# EAGLE design ADCv1_16_4_12 (EAGLE 5.10)
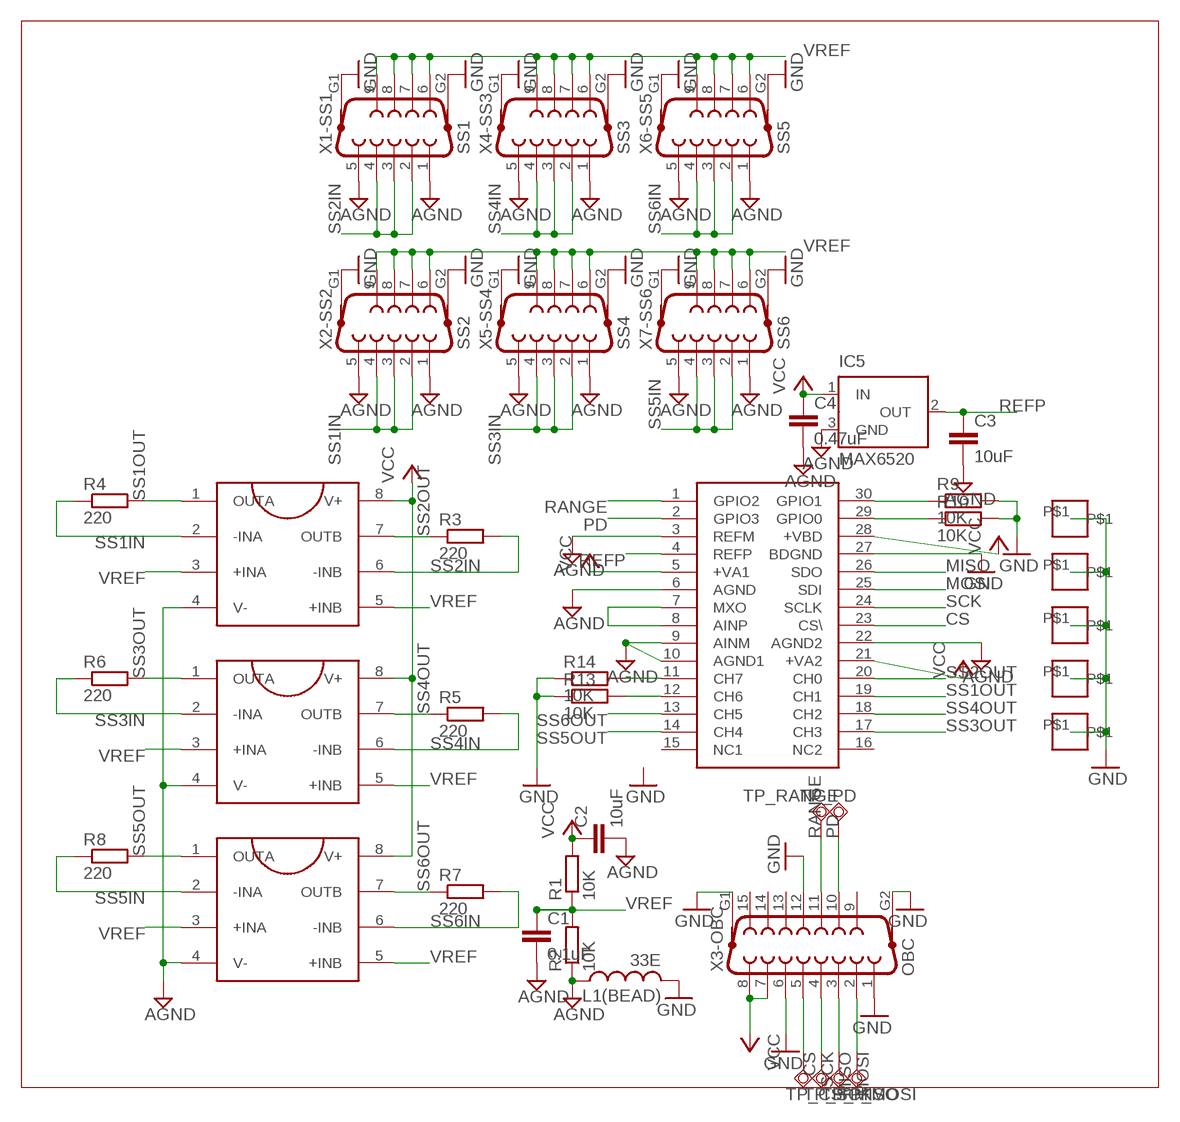
[diagram p0: schematic, sheet 1]

## Parts
C1  0.1uF  C-EUC1206  [C1206]
C2  10uF  C-EUC1206  [C1206]
C3  10uF  C-EUC1206  [C1206]
C4  0.47uF  C-EUC1206  [C1206]
IC1  ADS7951_  [TSSOP30_]
IC2  OPA2376  [SO-8]
IC3  OPA2376  [SO-8]
IC4  OPA2376  [SO-8]
IC5  MAX6520  [SOT23]
L1(BEAD)  33E  L-USL2012C  [L2012C]
R1  10K  R-EU_M1206  [M1206]
R2  10K  R-EU_M1206  [M1206]
R3  220  R-EU_M1206  [M1206]
R4  220  R-EU_M1206  [M1206]
R5  220  R-EU_M1206  [M1206]
R6  220  R-EU_M1206  [M1206]
R7  220  R-EU_M1206  [M1206]
R8  220  R-EU_M1206  [M1206]
R9  10K  R-EU_M1206  [M1206]
R10  10K  R-EU_M1206  [M1206]
R13  10K  R-EU_M1206  [M1206]
R14  10K  R-EU_M1206  [M1206]
TP_CS  TPSQTP12R  [TP12R]
TP_MISO  TPSQTP12R  [TP12R]
TP_MOSI  TPSQTP12R  [TP12R]
TP_PD  TPSQTP12R  [TP12R]
TP_RANGE  TPSQTP12R  [TP12R]
TP_SCK  TPSQTP12R  [TP12R]
U$1  MOUNT_SQ  [MOUNT_10MM]
U$6  MOUNT_SQ  [MOUNT_10MM]
U$7  MOUNT_SQ  [MOUNT_10MM]
U$8  MOUNT_SQ  [MOUNT_10MM]
U$9  MOUNT_SQ  [MOUNT_10MM]
X1-SS1  SS1  F09HP  [F09HP]
X2-SS2  SS2  F09HP  [F09HP]
X3-OBC  OBC  F15HP  [F15HP]
X4-SS3  SS3  F09HP  [F09HP]
X5-SS4  SS4  F09HP  [F09HP]
X6-SS5  SS5  F09HP  [F09HP]
X7-SS6  SS6  F09HP  [F09HP]

## Nets
AGND [Power]: C1.2 C2.2 C3.2 C4.2 IC1.3(REFM) IC1.6(AGND) IC1.9(AINM) IC1.10(AGND1) IC1.22(AGND2) IC2.4(V-) IC3.4(V-) IC4.4(V-) IC5.3(GND) L1(BEAD).1 R2.1 X1-SS1.1 X1-SS1.5 X2-SS2.1 X2-SS2.5 X4-SS3.1 X4-SS3.5 X5-SS4.1 X5-SS4.5 X6-SS5.1 X6-SS5.5 X7-SS6.1 X7-SS6.5
CS: IC1.23(CS\) TP_CS.TP X3-OBC.5
GND [Power]: IC1.27(BDGND) L1(BEAD).2 R9.2 R10.2 R13.1 R14.1 U$1.P$1 U$6.P$1 U$7.P$1 U$8.P$1 U$9.P$1 X1-SS1.G1 X1-SS1.G2 X2-SS2.G1 X2-SS2.G2 X3-OBC.1 X3-OBC.6 X3-OBC.12 X3-OBC.G1 X3-OBC.G2 X4-SS3.G1 X4-SS3.G2 X5-SS4.G1 X5-SS4.G2 X6-SS5.G1 X6-SS5.G2 X7-SS6.G1 X7-SS6.G2
MISO: IC1.26(SDO) TP_MISO.TP X3-OBC.3
MOSI: IC1.25(SDI) TP_MOSI.TP X3-OBC.2
N$1: IC1.7(MXO) IC1.8(AINP)
N$4: IC1.11(CH7) R14.2
N$5: IC1.12(CH6) R13.2
N$8: IC1.29(GPIO0) R10.1
N$9: IC1.30(GPIO1) R9.1
PD: IC1.2(GPIO3) TP_PD.TP X3-OBC.10
RANGE: IC1.1(GPIO2) TP_RANGE.TP X3-OBC.11
REFP: C3.1 IC1.4(REFP) IC5.2(OUT)
SCK: IC1.24(SCLK) TP_SCK.TP X3-OBC.4
SS1IN: IC2.2(-INA) R4.1 X2-SS2.2 X2-SS2.3 X2-SS2.4
SS1OUT: IC1.19(CH1) IC2.1(OUTA) R4.2
SS2IN: IC2.6(-INB) R3.2 X1-SS1.2 X1-SS1.3 X1-SS1.4
SS2OUT: IC1.20(CH0) IC2.7(OUTB) R3.1
SS3IN: IC3.2(-INA) R6.1 X5-SS4.2 X5-SS4.3 X5-SS4.4
SS3OUT: IC1.17(CH3) IC3.1(OUTA) R6.2
SS4IN: IC3.6(-INB) R5.2 X4-SS3.2 X4-SS3.3 X4-SS3.4
SS4OUT: IC1.18(CH2) IC3.7(OUTB) R5.1
SS5IN: IC4.2(-INA) R8.1 X7-SS6.2 X7-SS6.3 X7-SS6.4
SS5OUT: IC1.13(CH5) IC4.1(OUTA) R8.2
SS6IN: IC4.6(-INB) R7.2 X6-SS5.2 X6-SS5.3 X6-SS5.4
SS6OUT: IC1.14(CH4) IC4.7(OUTB) R7.1
VCC [Power]: C2.1 C4.1 IC1.5(+VA1) IC1.21(+VA2) IC1.28(+VBD) IC2.8(V+) IC3.8(V+) IC4.8(V+) IC5.1(IN) R1.2 X3-OBC.7 X3-OBC.8
VREF [Power]: C1.1 IC2.3(+INA) IC2.5(+INB) IC3.3(+INA) IC3.5(+INB) IC4.3(+INA) IC4.5(+INB) R1.1 R2.2 X1-SS1.6 X1-SS1.7 X1-SS1.8 X1-SS1.9 X2-SS2.6 X2-SS2.7 X2-SS2.8 X2-SS2.9 X4-SS3.6 X4-SS3.7 X4-SS3.8 X4-SS3.9 X5-SS4.6 X5-SS4.7 X5-SS4.8 X5-SS4.9 X6-SS5.6 X6-SS5.7 X6-SS5.8 X6-SS5.9 X7-SS6.6 X7-SS6.7 X7-SS6.8 X7-SS6.9
Unconnected: IC1.15(NC1) IC1.16(NC2) X3-OBC.9 X3-OBC.13 X3-OBC.14 X3-OBC.15

## Library data of the parts
C1-C4 = rcl:C-EU: CAPACITOR, European symbol
IC1 = satellite:ADS7951_
IC2-IC4 = satellite:OPA2376
IC5 = maxim:MAX6520: 1.2V Voltage Reference 50ppm/°C, SOT23, 3-Terminal Source: http://datasheets.maxim-ic.com/en/ds/MAX6520.pdf
L1(BEAD) = rcl:L-US: INDUCTOR, American symbol
R1 R2 = rcl:R-EU_: RESISTOR, European symbol
R3-R10 R13 R14 = satellite:R-EU_: RESISTOR, European symbol
TP_CS TP_MISO TP_MOSI TP_PD TP_RANGE TP_SCK = testpad:TPSQ: Test pad
U$1 U$6-U$9 = satellite:MOUNT_SQ
X1-SS1 X2-SS2 X4-SS3 X5-SS4 X6-SS5 X7-SS6 = satellite:F09HP: SUB-D
X3-OBC = satellite:F15HP: SUB-D

## Net classes
0 Signal: width 0.305 mm, clearance 0.254 mm
1 Power: width 0.61 mm, clearance 0.508 mm to class 0, clearance 0.508 mm

## Board
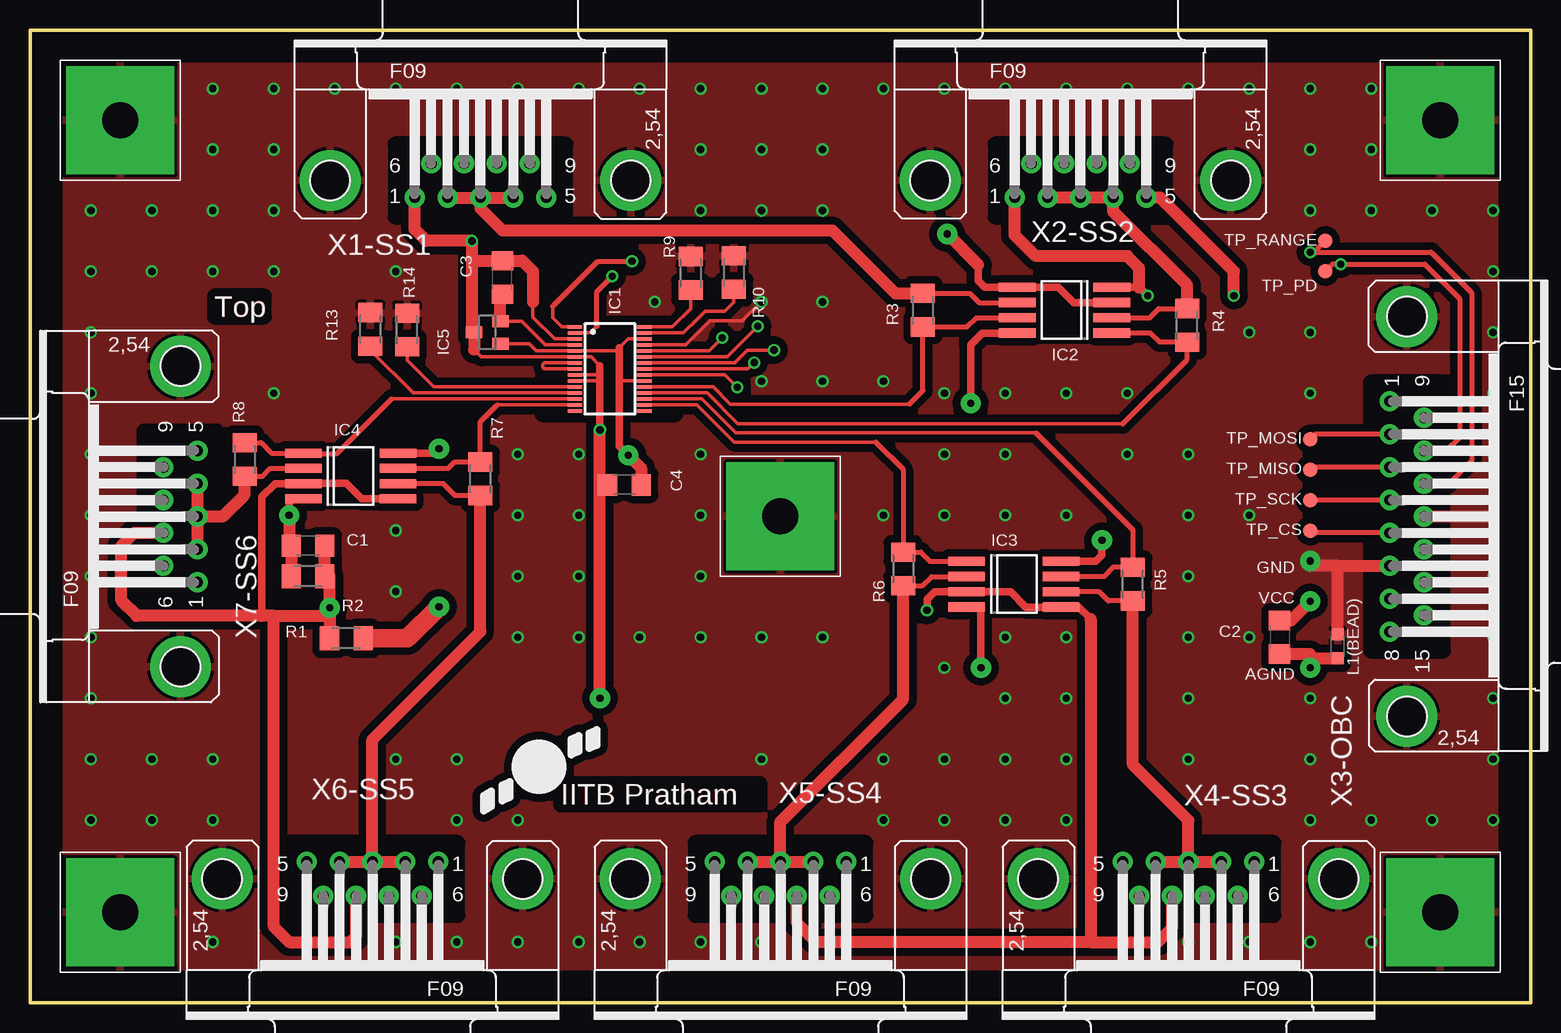
[diagram p1: board, top side]
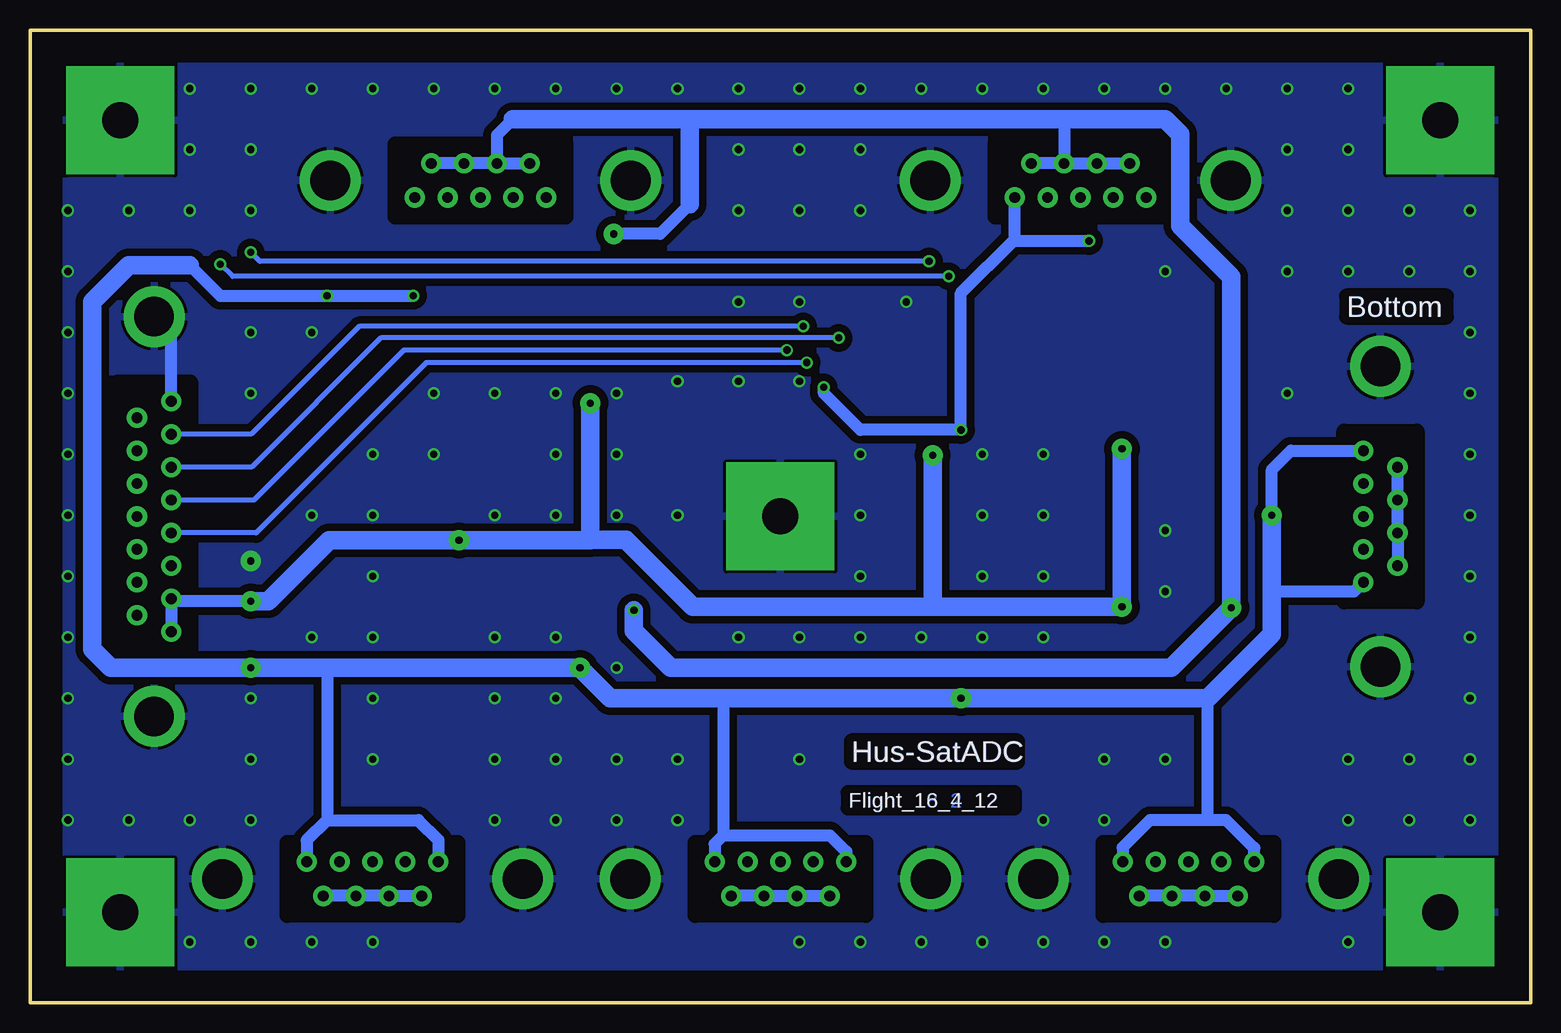
[diagram p2: board, bottom side, seen from below]

Size 125.08 x 81.08 mm. Coordinates in mm from the lower left corner, seen from the top.
Outline: 0,0 125.08,0 125.08,81.08 0,81.08 0,0
Copper layers (1*16): Top 0.07mm / dielectric 1.5mm / Bottom 0.07mm
Design rules "satellite": minimum track width 10mil, minimum drill 20mil, track to track 6mil, track to pad 6mil, pad to pad 6mil, via to via 6mil, smd to smd 6mil, copper to edge 100mil, drill to drill 8mil, minimum pad ring 10mil, minimum via ring 8mil, stop-mask expansion 4mil, vias tented up to drill 0mil, thermal gap 10mil
tRestrict: area 42.7,49 to 53.8,56.6

### Footprints (pad centres in the part's own frame; a part is rotated, then mirrored left to right if it is on the bottom)
C1206 = smd 1.6 x 1.8: 1 -1.4,0; 2 1.4,0
TSSOP30_ = smd 0.3 x 1.2: 1 -3.5,-2.9; 2 -3,-2.9; 3 -2.5,-2.9; 4 -2,-2.9; 5 -1.5,-2.9; 6 -1,-2.9; 7 -0.5,-2.9; 8 0,-2.9; 9 0.5,-2.9; 10 1,-2.9; 11 1.5,-2.9; 12 2,-2.9; 13 2.5,-2.9; 14 3,-2.9; 15 3.5,-2.9; 16 3.5,2.9; 17 3,2.9; 18 2.5,2.9; 19 2,2.9; 20 1.5,2.9; 21 1,2.9; 22 0.5,2.9; 23 0,2.9; 24 -0.5,2.9; 25 -1,2.9; 26 -1.5,2.9; 27 -2,2.9; 28 -2.5,2.9; 29 -3,2.9; 30 -3.5,2.9
SO-8 = smd 0.762 x 3.048: 1 -1.905,-3.937; 2 -0.635,-3.937; 3 0.635,-3.937; 4 1.905,-3.937; 5 1.905,3.937; 6 0.635,3.937; 7 -0.635,3.937; 8 -1.905,3.937
SOT23 = smd 1 x 1.4: 1 -0.95,-1.1; 2 0.95,-1.1; 3 0,1.1
L2012C = smd 1 x 1: 1 -1,0; 2 1,0
M1206 = smd 1.6 x 2: 1 -1.4,0; 2 1.4,0
TP12R = smd 1.2 x 1.2: TP 0,0
MOUNT_10MM = drill 3 pad 9 square: P$1 0,0
F09HP = drill 0.9 pad 1.676 round: 1 -5.486,-1.422; 2 -2.743,-1.422; 3 0,-1.422; 4 2.743,-1.422; 5 5.486,-1.422; 6 -4.115,1.422; 7 -1.372,1.422; 8 1.372,1.422; 9 4.115,1.422 | drill 3.302 pad 5.08 round: G1 -12.522,0; G2 12.522,0
F15HP = drill 0.9 pad 1.676 round: 1 -9.601,-1.422; 2 -6.858,-1.422; 3 -4.115,-1.422; 4 -1.372,-1.422; 5 1.372,-1.422; 6 4.115,-1.422; 7 6.858,-1.422; 8 9.601,-1.422; 9 -8.23,1.422; 10 -5.486,1.422; 11 -2.743,1.422; 12 0,1.422; 13 2.743,1.422; 14 5.486,1.422; 15 8.23,1.422 | drill 3.302 pad 5.08 round: G1 16.662,0; G2 -16.662,0

### Placement (x,y rotation side)
C1  23.16,38.1 180 top
C2  104.14,30.48 270 top
C3  39.37,60.45 90 top
C4  49.53,43.18 180 top
IC1  48.32,52.83 270 top
IC2  86.21,57.73 90 top
IC3  81.99,34.9 270 top
IC4  26.72,43.92 270 top
IC5  38.1,55.88 90 top
L1(BEAD)  108.97,29.72 90 top
R1  26.37,30.38 0 top
R2  23.16,35.56 0 top
R3  74.4,57.73 90 top
R4  96.42,56.46 270 top
R5  91.9,34.9 270 top
R6  72.76,36.17 90 top
R7  37.54,43.69 270 top
R8  17.88,45.29 90 top
R9  55.04,60.81 90 top
R10  58.66,60.87 90 top
R13  28.37,56.13 270 top
R14  31.42,56.08 270 top
TP_CS  106.68,39.37 0 top
TP_MISO  106.68,44.45 0 top
TP_MOSI  106.68,46.99 0 top
TP_PD  107.95,60.96 0 top
TP_RANGE  107.95,63.5 0 top
TP_SCK  106.68,41.91 0 top
U$1  7.54,7.54 0 top
U$6  7.54,73.54 0 top
U$7  117.54,7.54 0 top
U$8  117.54,73.54 0 top
U$9  62.54,40.54 0 top
X1-SS1  37.54,68.54 0 top
X2-SS2  87.54,68.54 0 top
X3-OBC  114.74,40.54 270 top
X4-SS3  96.54,10.34 180 top
X5-SS4  62.54,10.34 180 top
X6-SS5  28.54,10.34 180 top
X7-SS6  12.54,40.54 90 top

### Tracks (layer width: path | path; a pad name or v marks a point on that pad's centre or on a via)
AGND  (via drill 0.6, 0.6 pad 1.68)
  Top 0.305: IC1.22 57.9,52.33 v58.93,51.31 | 47.5,53.09 46.75,53.83 IC1.6 37.61,53.83 37,54.44 | IC1.3 43.73,55.33 41.91,57.15 41.91,58.42 | 47.5,52.33 IC1.9 | 47.5,51.83 IC1.10
  Top 0.61: v79.25,27.94 79.25,32.99 IC3.4 | IC2.4 92.43,59.64 v93.14,58.93 | v21.59,40.64 21.59,42.01 IC4.4 | 47.5,53.09 47.5,52.33 47.5,51.83 v47.5,47.75
  Top 1.016: v21.59,40.64 21.59,38.1 C1.2 R2.1 | X2-SS2.1 82.05,64 83.82,62.23 91.44,62.23 92.43,61.24 92.43,59.64 | X2-SS2.5 94.17,67.12 100.33,60.96 v100.33,58.93 | X1-SS1.1 32.05,64.47 33.02,63.5 v36.83,63.5 36.83,61.85 | C2.2 106.68,29.08 106.68,28.72 | v106.68,27.94 106.68,28.72 | 106.68,28.72 L1(BEAD).1 | 41.91,58.42 41.91,60.96 41.02,61.85 C3.2 36.83,61.85 | 47.5,43.18 C4.2 | 47.5,43.18 v47.5,47.75 | v47.5,25.4 47.5,43.18 | 36.83,61.85 36.83,55.88 IC5.3 37,54.44
  Bottom 1.016: v58.93,51.31 58.93,50.8 55.88,47.75 v47.5,47.75 47.5,59.18 43.03,63.65 | v93.14,58.93 v100.33,58.93 109.22,58.93 111.76,61.47 | X7-SS6.1 14.73,34.29 21.59,34.29 | X7-SS6.5 20.01,46.03 21.59,44.45 v21.59,40.64 | X6-SS5.5 23.05,12.89 25.4,15.24 26.92,15.24 | X6-SS5.1 34.03,12.96 31.75,15.24 26.92,15.24 | X5-SS4.5 57.05,12.6 58.42,13.97 67.31,13.97 | 67.31,25.4 67.31,13.97 | X5-SS4.1 68.03,13.25 67.31,13.97 | X4-SS3.1 102.03,13.54 100.33,15.24 | 100.33,27.94 100.33,15.24 | X4-SS3.5 91.05,13.58 92.71,15.24 100.33,15.24 | 26.92,15.24 26.92,25.4 | 43.03,63.65 X1-SS1.5 | 43.03,63.65 42.87,63.5 v36.83,63.5
  Bottom 1.524: v21.59,40.64 21.59,34.29 21.59,30.73 26.92,25.4 v47.5,25.4 67.31,25.4 76.71,25.4 v79.25,27.94 100.33,27.94 v106.68,27.94 118.36,27.94 119.89,29.46 119.89,58.42 116.84,61.47 111.76,61.47
CS  (via drill 0.6 pad 0.3)
  Top 0.305: v60.35,53.37 59.82,52.83 IC1.23
  Top 0.406: TP_CS.TP 106.88,39.17 X3-OBC.5
  Bottom 0.406: v60.35,53.37 92.05,53.37 106.25,39.17 X3-OBC.5
GND  (via drill 0.6, 0.6 pad 1.68)
  Top 0.305: IC1.27 54.64,54.83 56.64,56.83 59.37,56.83 v60.96,58.42
  Top 1.016: X3-OBC.12 121.82,40.54 v121.92,40.64 | L1(BEAD).2 108.97,36.42 | 108.97,36.42 X3-OBC.6 | v106.68,36.83 106.68,36.42 108.97,36.42
  Bottom 1.016: X3-OBC.G1 116.01,25.15 | X3-OBC.1 113.32,55.78 X3-OBC.G2
  other vias: 5.08,15.24 5.08,20.32 5.08,25.4 10.16,20.32 15.24,20.32 15.24,15.24 10.16,15.24 5.08,30.48 5.08,40.64 5.08,45.72 5.08,50.8 5.08,55.88 5.08,60.96 5.08,66.04 10.16,66.04 20.32,60.96 30.48,60.96 15.24,66.04 20.32,66.04 15.24,71.12 15.24,76.2 20.32,76.2 25.4,76.2 30.48,76.2 20.32,71.12 40.64,76.2 45.72,76.2 50.8,76.2 55.88,76.2 60.96,76.2 66.04,76.2 71.12,76.2 76.2,76.2 81.28,76.2 91.44,76.2 96.52,76.2 101.6,76.2 106.68,76.2 111.76,76.2 111.76,71.12 111.76,66.04 116.84,66.04 106.68,71.12 106.68,66.04 106.68,55.88 101.6,55.88 106.68,50.8 66.04,71.12 66.04,66.04 60.96,66.04 60.96,71.12 55.88,71.12 55.88,66.04 52.07,58.42 30.48,39.37 40.64,45.72 40.64,35.56 40.64,40.64 35.56,15.24 40.64,15.24 71.12,15.24 76.2,15.24 81.28,15.24 86.36,15.24 106.68,15.24 111.76,15.24 116.84,15.24 106.68,20.32 106.68,25.4 15.24,5.08 35.56,5.08 40.64,5.08 45.72,5.08 50.8,5.08 55.88,5.08 96.52,5.08 106.68,5.08 111.76,5.08 121.92,15.24 121.92,20.32 121.92,25.4 121.92,30.48 121.92,35.56 121.92,45.72 121.92,50.8 121.92,55.88 121.92,60.96 121.92,66.04 45.72,35.56 45.72,40.64 55.88,35.56 55.88,40.64 71.12,40.64 81.28,40.64 86.36,40.64 96.52,40.64 96.52,35.56 101.6,30.48 96.52,25.4 96.52,20.32 86.36,20.32 86.36,25.4 81.28,25.4 81.28,20.32 76.2,20.32 40.64,30.48 45.72,30.48 50.8,30.48 55.88,30.48 60.96,30.48 60.96,20.32 35.56,20.32 30.48,20.32 45.72,45.72 76.2,50.8 81.28,50.8 86.36,50.8 71.12,51.82 66.04,30.48 35.56,76.2 86.36,76.2 5.08,35.56 30.48,5.08 101.6,5.08 60.96,5.08 10.16,60.96 15.24,60.96 96.52,30.48 86.36,30.48 81.28,30.48 91.44,50.8 101.6,40.64 96.52,45.72 91.44,45.72 81.28,45.72 76.2,45.72 76.2,40.64 30.48,34.29 76.2,27.94 66.04,58.42 60.96,51.82 66.04,51.82 71.12,20.32 20.32,50.8 55.88,45.72
  pour Top (isolate 0.635): 2.54,78.54 122.54,78.54 122.54,2.54 2.54,2.54
  pour Bottom (isolate 0.635): 2.54,78.54 122.54,78.54 122.54,2.54 2.54,2.54
MISO  (via drill 0.6 pad 0.3)
  Top 0.305: IC1.26 56.59,54.33 v57.68,55.42
  Top 0.406: TP_MISO.TP 106.89,44.66 X3-OBC.3
  Bottom 0.406: v57.68,55.42 95.83,55.42 106.6,44.66 X3-OBC.3
MOSI  (via drill 0.6)
  Top 0.305: IC1.25 58.09,53.83 v60.64,56.39
  Top 0.406: TP_MOSI.TP 107.09,47.4 X3-OBC.2
  Bottom 0.406: v60.64,56.39 97.66,56.39 106.65,47.4 X3-OBC.2
N$1
  Top 0.305: IC1.7 42.85,53.33 42.74,53.21 42.74,52.96 42.86,52.83 IC1.8
N$2
  Top 0.61: 45.09,21.97 45.72,22.25 45.72,20.98 45.09,20.7 45.09,21.97
N$3
  Top 0.61: 46.61,22.48 47.24,22.76 47.24,21.49 46.61,21.21 46.61,22.48
N$4
  Top 0.305: R14.2 31.42,53.54 33.63,51.33 IC1.11
N$5
  Top 0.305: R13.2 28.37,54.41 31.95,50.83 IC1.12
N$8
  Top 0.305: 55.59,56.99 55.31,56.71 | 55.59,56.99 56.26,57.66 57.91,57.66 58.66,58.41 R10.1 | IC1.29 54.44,55.83 55.59,56.99
N$9
  Top 0.305: IC1.30 53.54,56.33 55.04,57.84 R9.1
N$10
  Top 0.61: 39.34,18.14 39.98,18.41 39.98,17.14 39.34,16.87 39.34,18.14
N$11
  Top 0.61: 37.82,17.27 38.46,17.65 38.46,16.38 37.82,16 37.82,17.27
PD  (via drill 0.6, 0.6 pad 0.3)
  Top 0.305: IC1.2 46.69,55.83 47.24,56.39
  Top 0.406: X3-OBC.10 118.04,46.03 119.13,47.12 119.13,58.67 116.23,61.57 v109.22,61.57 108.56,61.57 TP_PD.TP | 47.24,56.39 47.24,59.28 v48.51,60.55
  Bottom 0.406: v109.22,61.57 108.2,60.55 v48.51,60.55
RANGE  (via drill 0.6, 0.6 pad 0.3)
  Top 0.305: 43.56,58.04 43.56,57.09 44.32,56.33 IC1.1
  Top 0.406: v50.16,61.8 47.32,61.8 43.56,58.04 | X3-OBC.11 118.21,43.28 120.14,45.21 120.14,59.18 116.76,62.56 v106.68,62.56 107.01,62.56 TP_RANGE.TP
  Bottom 0.406: v106.68,62.56 105.92,61.8 v50.16,61.8
REFP
  Top 0.305: IC1.4 42.96,54.83 40.96,56.83 IC5.2
  Top 1.016: C3.1 39.2,59.05 IC5.2
SCK  (via drill 0.6 pad 0.3)
  Top 0.305: v62,54.41 59.79,54.41 58.72,53.33 IC1.24
  Top 0.406: TP_SCK.TP X3-OBC.4
  Bottom 0.406: v62,54.41 93.93,54.41 106.42,41.91 X3-OBC.4
SS1IN
  Top 0.406: IC2.2 93.29,57.1 94.06,57.86 R4.1
  Top 1.016: R4.1 96.42,59.79 90.28,65.93 X2-SS2.4 X2-SS2.3 X2-SS2.2
SS1OUT
  Top 0.305: 91.06,48.26 58.99,48.26 56.42,50.83 IC1.19
  Top 0.406: IC2.1 93.37,55.83 94.14,55.06 R4.2 96.42,53.62 91.06,48.26
SS2IN
  Top 0.406: IC2.6 79.1,58.37 78.33,59.13 R3.2
  Top 1.016: R3.2 72.12,59.13 66.87,64.39 39.37,64.39 37.54,66.22 X1-SS1.3 | X1-SS1.3 X1-SS1.4 | X1-SS1.2 X1-SS1.3
SS2OUT
  Top 0.305: 73.28,49.91 58.36,49.91 56.94,51.33 IC1.20
  Top 0.406: IC2.7 78.84,57.1 78.08,56.33 R3.1 74.4,51.03 73.28,49.91
SS3IN
  Top 0.406: IC3.2 75.13,35.53 74.37,34.77 R6.1
  Top 1.016: X5-SS4.3 X5-SS4.2 | X5-SS4.4 X5-SS4.3 | R6.1 72.76,25.32 62.54,15.11 X5-SS4.3
SS3OUT
  Top 0.305: 70.48,46.74 58.67,46.74 55.58,49.83 IC1.17
  Top 0.406: IC3.1 75.01,36.8 74.24,37.57 R6.2 72.76,44.46 70.48,46.74
SS4IN
  Top 0.406: IC3.6 89.1,34.27 89.87,33.5 R5.2
  Top 1.016: X4-SS3.3 X4-SS3.2 | X4-SS3.4 X4-SS3.3 | R5.2 91.9,19.86 96.54,15.22 X4-SS3.3
SS4OUT
  Top 0.305: 83.82,47.5 58.8,47.5 55.97,50.33 IC1.18
  Top 0.406: IC3.7 89.48,35.53 90.25,36.3 R5.1 91.9,39.42 83.82,47.5
SS5IN
  Top 0.406: IC4.2 20.04,44.55 19.38,43.89 R8.1
  Top 1.016: R8.1 17.88,42.37 16.05,40.54 X7-SS6.3 | X7-SS6.3 X7-SS6.4 | X7-SS6.2 X7-SS6.3
SS5OUT
  Top 0.305: IC4.1 22.84,45.77 | 30.14,50.33 IC1.13
  Top 0.406: IC4.1 20.12,45.82 19.25,46.69 R8.2 | 22.84,45.77 25.58,45.77 30.14,50.33
SS6IN
  Top 0.406: IC4.6 34.44,43.28 35.44,42.29 R7.2
  Top 1.016: X6-SS5.4 X6-SS5.3 | X6-SS5.3 X6-SS5.2 | X6-SS5.3 28.54,21.94 37.54,30.94 R7.2
SS6OUT
  Top 0.305: 38.94,49.83 IC1.14
  Top 0.406: IC4.7 34.87,44.55 35.41,45.09 R7.1 37.54,48.43 38.94,49.83
VCC  (via drill 0.6 pad 1.68)
  Top 0.305: 49.1,54.33 IC1.5 42.19,54.33 41.59,54.93 IC5.1 | IC1.28 49.84,55.33 49.1,54.59 | 49.1,51.83 IC1.21
  Top 0.61: v78.38,49.98 78.38,54.86 | 88.82,36.8 89.33,37.31 v89.33,38.55 | v49.86,45.64 49.1,46.41 49.1,51.83 49.1,54.33 49.1,54.59
  Top 0.635: 88.82,36.8 IC3.8 | IC2.8 79.35,55.83 78.38,54.86 | IC4.8 33.74,45.82 v34.09,46.17
  Top 1.016: C2.1 105.09,31.88 v106.68,33.47 | C4.1 50.93,44.57 v49.86,45.64
  Top 1.524: R1.2 31.45,30.38 v34.09,33.02
  Bottom 1.016: v106.68,33.47 113.32,33.47 X3-OBC.7 X3-OBC.8
  Bottom 1.524: v106.68,33.47 105.21,33.47 100.13,38.55 v89.33,38.55 78.38,38.55 78.38,38.61 | 49.86,33.02 69.85,33.02 75.38,38.55 75.38,38.61 78.38,38.61 | 49.86,33.02 v49.86,45.64 | 49.86,33.02 v34.09,33.02 v34.09,46.17 | 78.38,38.61 v78.38,49.98
VREF  (via drill 0.6 pad 0.64, 0.6 pad 1.68)
  Top 0.61: 79.02,61.49 79.02,60.2 | 20.42,43.28 19.3,42.16 19.3,32.26 | 88.39,32 87.4,32.99 IC3.5
  Top 0.635: IC2.3 86.97,58.37 85.7,59.64 IC2.5 79.58,59.64 79.02,60.2 | IC3.5 82.98,32.99 81.71,34.27 IC3.3 75.39,34.27 74.75,33.63 v74.75,32.72 | 20.42,43.28 IC4.3 22.81,43.31 26.36,43.31 27.66,42.01 IC4.5
  Top 1.016: X7-SS6.7 8.69,39.17 7.62,38.1 7.62,33.53 8.89,32.26 19.3,32.26 20.32,32.26 | X6-SS5.8 27.17,5.58 26.67,5.08 21.59,5.08 20.32,6.35 20.32,32.26 | X5-SS4.7 63.91,6.7 65.53,5.08 88.39,5.08 | 88.39,32 88.39,5.08 | X4-SS3.8 95.17,6.27 93.98,5.08 88.39,5.08 | v76.43,64.08 79.02,61.49 | C1.1 R2.2 24.97,35.56 v24.97,32.94 24.97,32.26 | 20.32,32.26 24.97,32.26 | R1.1 24.97,32.26
  Bottom 1.016: X6-SS5.9 X6-SS5.8 X6-SS5.7 X6-SS5.6 | X1-SS1.6 X1-SS1.7 X1-SS1.8 | X1-SS1.8 X1-SS1.9 | X4-SS3.9 X4-SS3.8 X4-SS3.7 X4-SS3.6 | X7-SS6.9 X7-SS6.8 X7-SS6.7 X7-SS6.6 | X5-SS4.9 X5-SS4.8 X5-SS4.7 X5-SS4.6 | X2-SS2.7 X2-SS2.6 | X2-SS2.7 86.17,72.33 84.84,73.66 | v76.43,64.08 72.57,64.08 70.1,66.55 | X2-SS2.7 X2-SS2.8 X2-SS2.9 | 38.91,73.66 X1-SS1.8
  Bottom 1.524: v74.75,32.72 74.75,31 71.69,27.94 29.97,27.94 v24.97,32.94 24.97,60.53 29.21,64.77 29.21,72.39 30.48,73.66 38.91,73.66 70.1,73.66 | 70.1,73.66 84.84,73.66 | v76.43,64.08 76.38,64.14 | 70.1,73.66 70.1,66.55
(copper drawn outside any net)
  shapes: Top circle x1

### Text on the board
Top: Top | IITB Pratham
Bottom: Bottom | Hus-SatADC | Flight_18_2_12
tPlace: Top | IITB Pratham
bPlace: Bottom | Hus-SatADC | Flight_16_4_12
tNames: GND | VCC | AGND